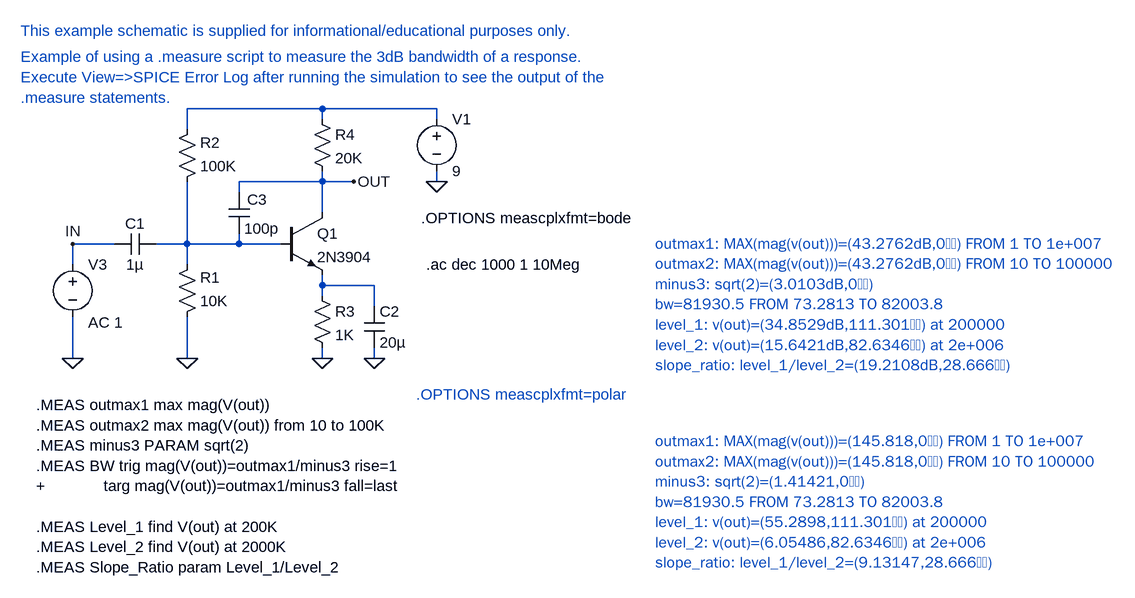
[diagram p0: schematic Fig_4-51_AC_1Tr_MEAS.asc]
Fig_4-51_AC_1Tr_MEAS.asc, the LTspice schematic file:
Version 4
SHEET 1 2456 1936
WIRE 400 1152 192 1152
WIRE 576 1152 400 1152
WIRE 400 1168 400 1152
WIRE 576 1168 576 1152
WIRE 192 1184 192 1152
WIRE 400 1264 400 1248
WIRE 400 1264 272 1264
WIRE 448 1264 400 1264
WIRE 576 1264 576 1248
WIRE 272 1280 272 1264
WIRE 400 1312 400 1264
WIRE 80 1360 16 1360
WIRE 192 1360 192 1264
WIRE 192 1360 144 1360
WIRE 272 1360 272 1344
WIRE 272 1360 192 1360
WIRE 336 1360 272 1360
WIRE 16 1392 16 1360
WIRE 192 1392 192 1360
WIRE 400 1424 400 1408
WIRE 480 1424 400 1424
WIRE 400 1440 400 1424
WIRE 480 1456 480 1424
WIRE 16 1536 16 1472
WIRE 192 1536 192 1472
WIRE 400 1536 400 1520
WIRE 480 1536 480 1520
FLAG 16 1536 0
FLAG 16 1360 IN
FLAG 192 1536 0
FLAG 400 1536 0
FLAG 448 1264 OUT
FLAG 576 1264 0
FLAG 480 1536 0
SYMBOL npn 336 1312 R0
SYMATTR InstName Q1
SYMATTR Value 2N3904
SYMBOL res 384 1424 R0
SYMATTR InstName R3
SYMATTR Value 1K
SYMBOL voltage 16 1376 R0
WINDOW 123 24 105 Left 2
SYMATTR Value2 AC 1
SYMATTR InstName V3
SYMATTR Value ""
SYMBOL res 176 1488 M180
WINDOW 0 36 76 Left 2
WINDOW 3 36 40 Left 2
SYMATTR InstName R1
SYMATTR Value 10K
SYMBOL cap 144 1344 R90
WINDOW 0 0 32 VBottom 2
WINDOW 3 32 32 VTop 2
SYMATTR InstName C1
SYMATTR Value 1µ
SYMBOL res 176 1280 M180
WINDOW 0 36 76 Left 2
WINDOW 3 36 40 Left 2
SYMATTR InstName R2
SYMATTR Value 100K
SYMBOL voltage 576 1152 R0
SYMATTR InstName V1
SYMATTR Value 9
SYMBOL cap 464 1456 R0
SYMATTR InstName C2
SYMATTR Value 20µ
SYMBOL res 384 1152 R0
SYMATTR InstName R4
SYMATTR Value 20K
SYMBOL cap 256 1344 M180
WINDOW 0 28 52 Left 2
WINDOW 3 24 8 Left 2
SYMATTR InstName C3
SYMATTR Value 100p
TEXT 560 1392 Left 2 !.ac dec 1000 1 10Meg
TEXT -64 1032 Left 2 ;This example schematic is supplied for informational/educational purposes only.
TEXT -40 1608 Left 2 !.MEAS outmax1 max mag(V(out))\n.MEAS outmax2 max mag(V(out)) from 10 to 100K\n.MEAS minus3 PARAM sqrt(2)\n.MEAS BW trig mag(V(out))=outmax1/minus3 rise=1\n+             targ mag(V(out))=outmax1/minus3 fall=last\n \n.MEAS Level_1 find V(out) at 200K\n.MEAS Level_2 find V(out) at 2000K\n.MEAS Slope_Ratio param Level_1/Level_2
TEXT -64 1072 Left 2 ;Example of using a .measure script to measure the 3dB bandwidth of a response.\nExecute View=>SPICE Error Log after running the simulation to see the output of the\n.measure statements.
TEXT 912 1360 Left 2 ;outmax1: MAX(mag(v(out)))=(43.2762dB,0�‹) FROM 1 TO 1e+007\noutmax2: MAX(mag(v(out)))=(43.2762dB,0�‹) FROM 10 TO 100000\nminus3: sqrt(2)=(3.0103dB,0�‹)\nbw=81930.5 FROM 73.2813 TO 82003.8\nlevel_1: v(out)=(34.8529dB,111.301�‹) at 200000\nlevel_2: v(out)=(15.6421dB,82.6346�‹) at 2e+006\nslope_ratio: level_1/level_2=(19.2108dB,28.666�‹)
TEXT 544 1592 Left 2 ;.OPTIONS meascplxfmt=polar
TEXT 912 1664 Left 2 ;outmax1: MAX(mag(v(out)))=(145.818,0�‹) FROM 1 TO 1e+007\noutmax2: MAX(mag(v(out)))=(145.818,0�‹) FROM 10 TO 100000\nminus3: sqrt(2)=(1.41421,0�‹)\nbw=81930.5 FROM 73.2813 TO 82003.8\nlevel_1: v(out)=(55.2898,111.301�‹) at 200000\nlevel_2: v(out)=(6.05486,82.6346�‹) at 2e+006\nslope_ratio: level_1/level_2=(9.13147,28.666�‹)
TEXT 552 1320 Left 2 !.OPTIONS meascplxfmt=bode

The netlist it stands for:
* Fig_4-51_AC_1Tr_MEAS.asc
Q1 OUT N002 N003 0 2N3904
R3 N003 0 1K
V3 IN 0 AC 1
R1 0 N002 10K
C1 N002 IN 1µ
R2 N002 N001 100K
V1 N001 0 9
C2 N003 0 20µ
R4 N001 OUT 20K
C3 N002 OUT 100p
.model NPN NPN
.model PNP PNP
.lib standard.bjt
.ac dec 1000 1 10Meg
* This example schematic is supplied for informational/educational purposes only.
.MEAS outmax1 max mag(V(out))
.MEAS outmax2 max mag(V(out)) from 10 to 100K
.MEAS minus3 PARAM sqrt(2)
.MEAS BW trig mag(V(out))=outmax1/minus3 rise=1
+             targ mag(V(out))=outmax1/minus3 fall=last
.MEAS Level_1 find V(out) at 200K
.MEAS Level_2 find V(out) at 2000K
.MEAS Slope_Ratio param Level_1/Level_2
* Example of using a .measure script to measure the 3dB bandwidth of a response.
* Execute View=>SPICE Error Log after running the simulation to see the output of the
* .measure statements.
* outmax1: MAX(mag(v(out)))=(43.2762dB,0�‹) FROM 1 TO 1e+007
* outmax2: MAX(mag(v(out)))=(43.2762dB,0�‹) FROM 10 TO 100000
* minus3: sqrt(2)=(3.0103dB,0�‹)
* bw=81930.5 FROM 73.2813 TO 82003.8
* level_1: v(out)=(34.8529dB,111.301�‹) at 200000
* level_2: v(out)=(15.6421dB,82.6346�‹) at 2e+006
* slope_ratio: level_1/level_2=(19.2108dB,28.666�‹)
* .OPTIONS meascplxfmt=polar
* outmax1: MAX(mag(v(out)))=(145.818,0�‹) FROM 1 TO 1e+007
* outmax2: MAX(mag(v(out)))=(145.818,0�‹) FROM 10 TO 100000
* minus3: sqrt(2)=(1.41421,0�‹)
* bw=81930.5 FROM 73.2813 TO 82003.8
* level_1: v(out)=(55.2898,111.301�‹) at 200000
* level_2: v(out)=(6.05486,82.6346�‹) at 2e+006
* slope_ratio: level_1/level_2=(9.13147,28.666�‹)
.OPTIONS meascplxfmt=bode
.backanno
.end